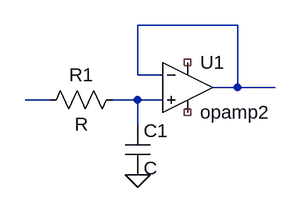
[diagram p0: schematic primeiraOrdem.asc]
primeiraOrdem.asc, the LTspice schematic file:
Version 4
SHEET 1 880 680
WIRE 128 96 0 96
WIRE 0 160 0 96
WIRE 32 160 0 160
WIRE 128 176 128 96
WIRE 128 176 96 176
WIRE 176 176 128 176
WIRE -112 192 -144 192
WIRE 0 192 -32 192
WIRE 32 192 0 192
WIRE 0 224 0 192
FLAG 0 288 0
SYMBOL OpAmps\\opamp2 64 112 R0
SYMATTR InstName U1
SYMBOL cap -16 224 R0
SYMATTR InstName C1
SYMBOL res -16 176 R90
WINDOW 0 0 56 VBottom 2
WINDOW 3 32 56 VTop 2
SYMATTR InstName R1

The netlist it stands for:
* primeiraOrdem.asc
XU1 N003 N001 NC_01 NC_02 N001 opamp2  ; pins In+ In- V+ V- OUT
C1 N003 0 C
R1 N003 N002 R
.backanno
.end